# Altium schematic sheet Safety Loop.SchDoc
size A4; SheetNumber: 6; SheetTotal: 6
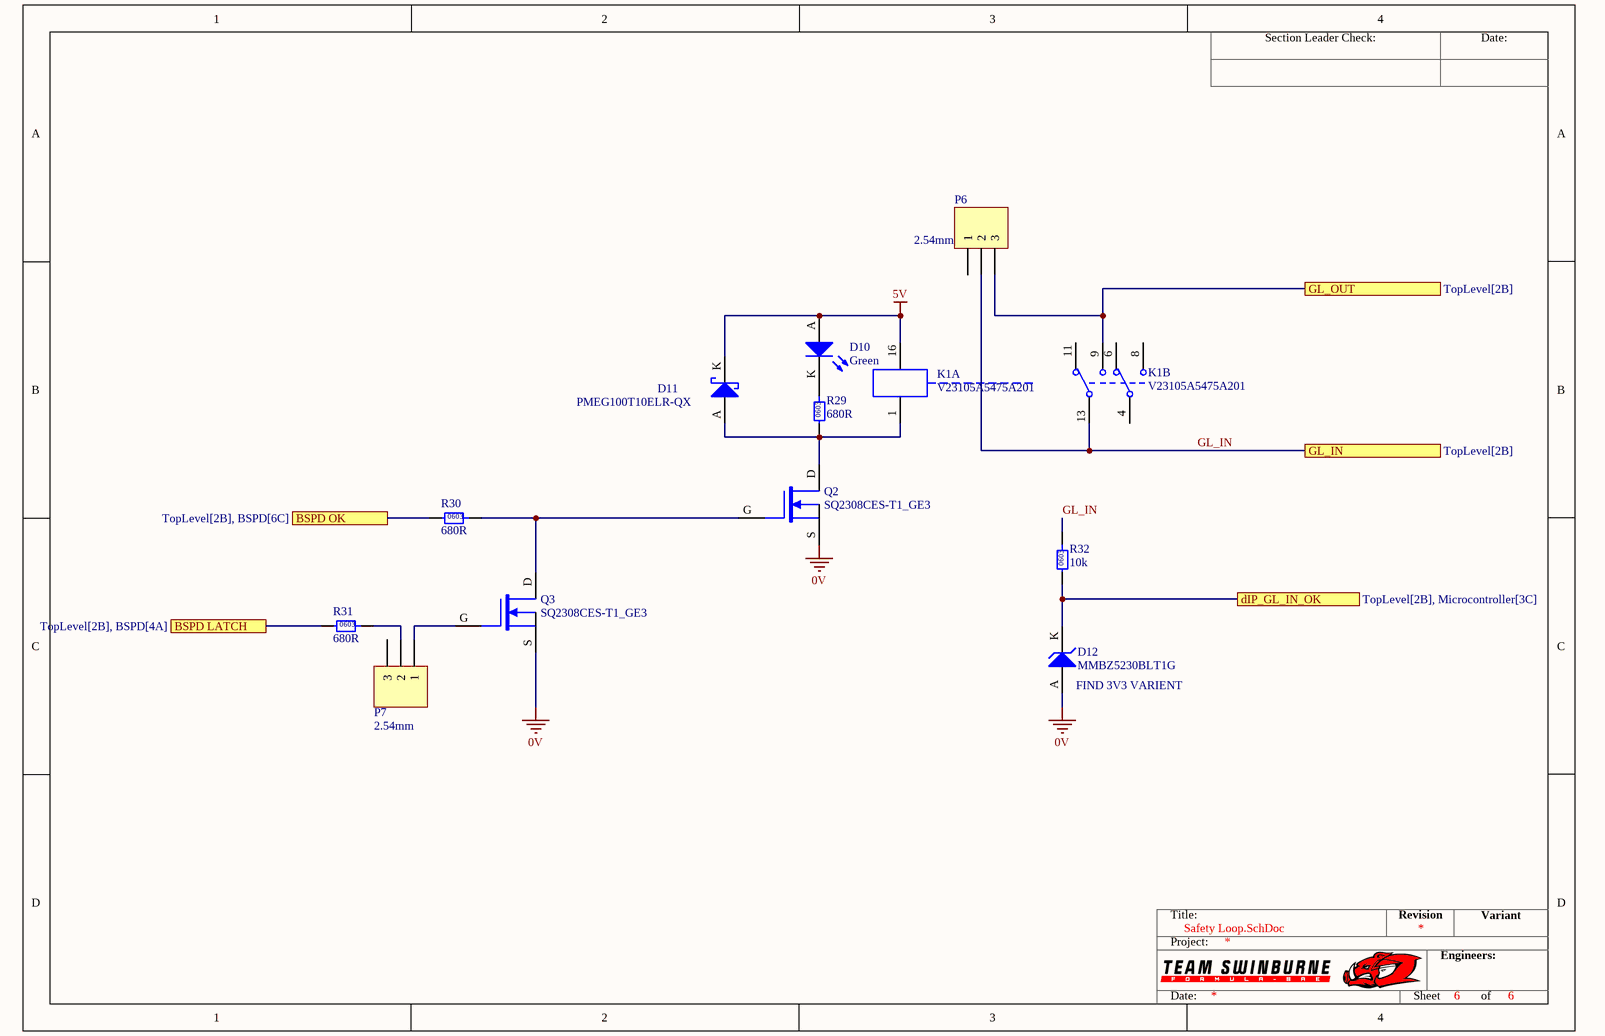
[diagram p0: Safety Loop.SchDoc]

## Parts
D10  Green  [0805 LED]
D11  PMEG100T10ELR-QX  [NXP SOD123W]
D12  MMBZ5230BLT1G  [NEXPERIA_SOT23]
K1  V23105A5475A201  [TI 2-DIL]  (parts A,B of 2)
P6  2.54mm  [TH 2.54mm Header 1x3]
P7  2.54mm  [TH 2.54mm Header 1x3]
Q2  SQ2308CES-T1_GE3  [VSHY SOT-23-3]
Q3  SQ2308CES-T1_GE3  [VSHY SOT-23-3]
R29  680R  [0603]
R30  680R  [0603]
R31  680R  [0603]
R32  10k  [0603]

## Ports
BSPD LATCH (see TopLevel[2B], BSPD[4A]), BSPD OK (see TopLevel[2B], BSPD[6C]), dIP_GL_IN_OK (see TopLevel[2B], Microcontroller[3C]), GL_IN (see TopLevel[2B]), GL_OUT (see TopLevel[2B])

## Nets
0V: D12.A Q2.S Q3.S
5V: D10.A D11.K K1.16
BSPD LATCH: R31.1 ; port BSPD LATCH
BSPD OK: R30.1 ; port BSPD OK
dIP_GL_IN_OK: D12.K R32.1 ; port dIP_GL_IN_OK
GL_IN: K1.13 P6.2 R32.2 ; port GL_IN
GL_OUT: K1.9 P6.3 ; port GL_OUT
NetD10_K: D10.K R29.2
NetD11_A: D11.A K1.1 Q2.D R29.1
NetP7_1: P7.1 Q3.G
NetP7_2: P7.2 R31.2
NetQ2_G: Q2.G Q3.D R30.2

Not connected (* = marked no-connect by the designer): K1 4 6 8 11; P6 1; P7 3

## Notes on the sheet
- (near D12) FIND 3V3 VARIENT
- Section Leader Check:
- Date:
- Title:
- Revision
- Variant
- Project:
- Engineers:
- Sheet
- of
- (in symbol RC0603FR-0710KL) 0603
- (in symbol RC0603JR-13680RL) 0603

## Library data of the parts
D10 = SML-210FTT86: Green LED Indication - Discrete 1.75V 0805 (2012 Metric); Manufacturer: ROHM Semiconductor; Part Number: SML-210FTT86; Colour: Green; Digikey Part Number: 511-1285-1-ND
D11 = PMEG100T10ELR-QX: Manufacturer: Nexperia USA Inc.; Forward Voltage: 0.75 V @ 1A; Breakdown Voltage: 100 V; Rated Power: 680 mW; Part Number: PMEG100T10ELR-QX; Digikey Part Number: 1727-PMEG100T10ELR-QXCT-ND
D12 = MMBZ5230BLT1G: Manufacturer: onsemi; Breakdown Voltage: 4.7V; Rated Power: 225mW; Part Number: MMBZ5230BLT1G; Digikey Part Number: MMBZ5230BLT1GOSTR-ND
K1 = V23105A5475A201: 5V DPDT Relay 3A 220VDC; Manufacturer: Axicom; Part Number: V23105A5475A201; Digikey Part Number: PB383-ND; Digikey Link: https://www.digikey.com/products/en?mpart=V23105A5001A201&v=41
P6 P7 = TH 2.54mm Header 1x3: Positions: 3; Angle: 0; Flange: No; Contact: NA; Part Number: TH 2.54mm Header 1x3; Pitch: 2.54mm; Row Spacing: 2.54mm
Q2 Q3 = SQ2308CES-T1_GE3: MOSFET N-CH 60V 2.3A SOT23; Manufacturer: Vishay Siliconix; Type: N-channel; Rated Power: 2W; Published: 24-Mar-1999; LatestRevisionDate: 29-May-2009; LatestRevisionNote: IPC-7351 Footprint Added.; PackageVersion: Sep-2000; PackageReference: SOT-343; Publisher: Altium Limited; PackageDescription: 4-Pin SOT-343 Package 1.3 mm Pitch, 2.1 mm Lead Span; Part Number: SQ2308CES-T1_GE3; Digikey Part Number: SQ2308CES-T1_GE3CT-ND
R29-R31 = RC0603JR-13680RL: Manufacturer: YAGEO; Tolerance: 0.01; Rated Power: 0.1W; Part Number: RC0603JR-13680RL; Value: 680R; Material: FR-07; Digikey Part Number: 13-RC0603JR-13680RLCT-ND
R32 = RC0603FR-0710KL: Manufacturer: YAGEO; Tolerance: 0.01; Rated Power: 0.1W; Part Number: RC0603FR-0710KL; Value: 10k; Material: FR-07; Digikey Part Number: 311-10.0KHRCT-ND